# Altium schematic sheet VLC_RX.SchDoc
size A4; SheetNumber: 1; SheetTotal: 4
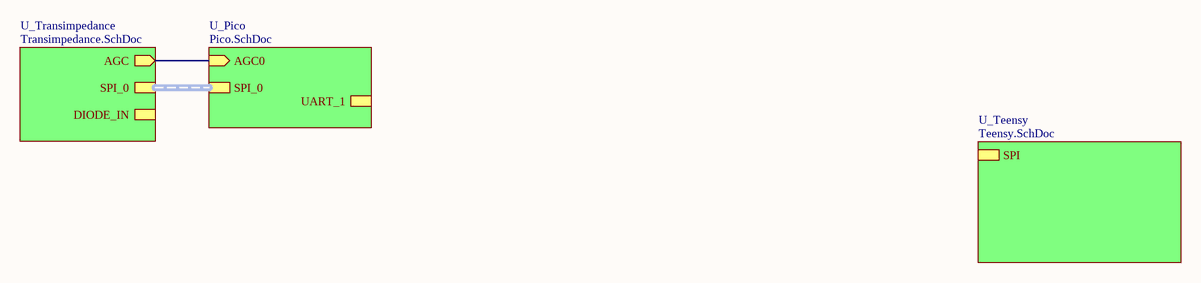
[diagram p0: VLC_RX.SchDoc]

## Sub-sheets
U_Pico = Pico.SchDoc: SPI_0 (harness SPI_0), AGC0 (in), UART_1 (harness UART_1)
U_Teensy = Teensy.SchDoc: SPI (harness SPI)
U_Transimpedance = Transimpedance.SchDoc: DIODE_IN, SPI_0 (harness SPI_0), AGC (out)

## Nets
(unnamed): sheet U_Pico/AGC0, sheet U_Transimpedance/AGC

## Buses and harness runs
harness sheet U_Pico/SPI_0 = sheet U_Transimpedance/SPI_0